# EAGLE schematic mux (EAGLE 7.1.0)
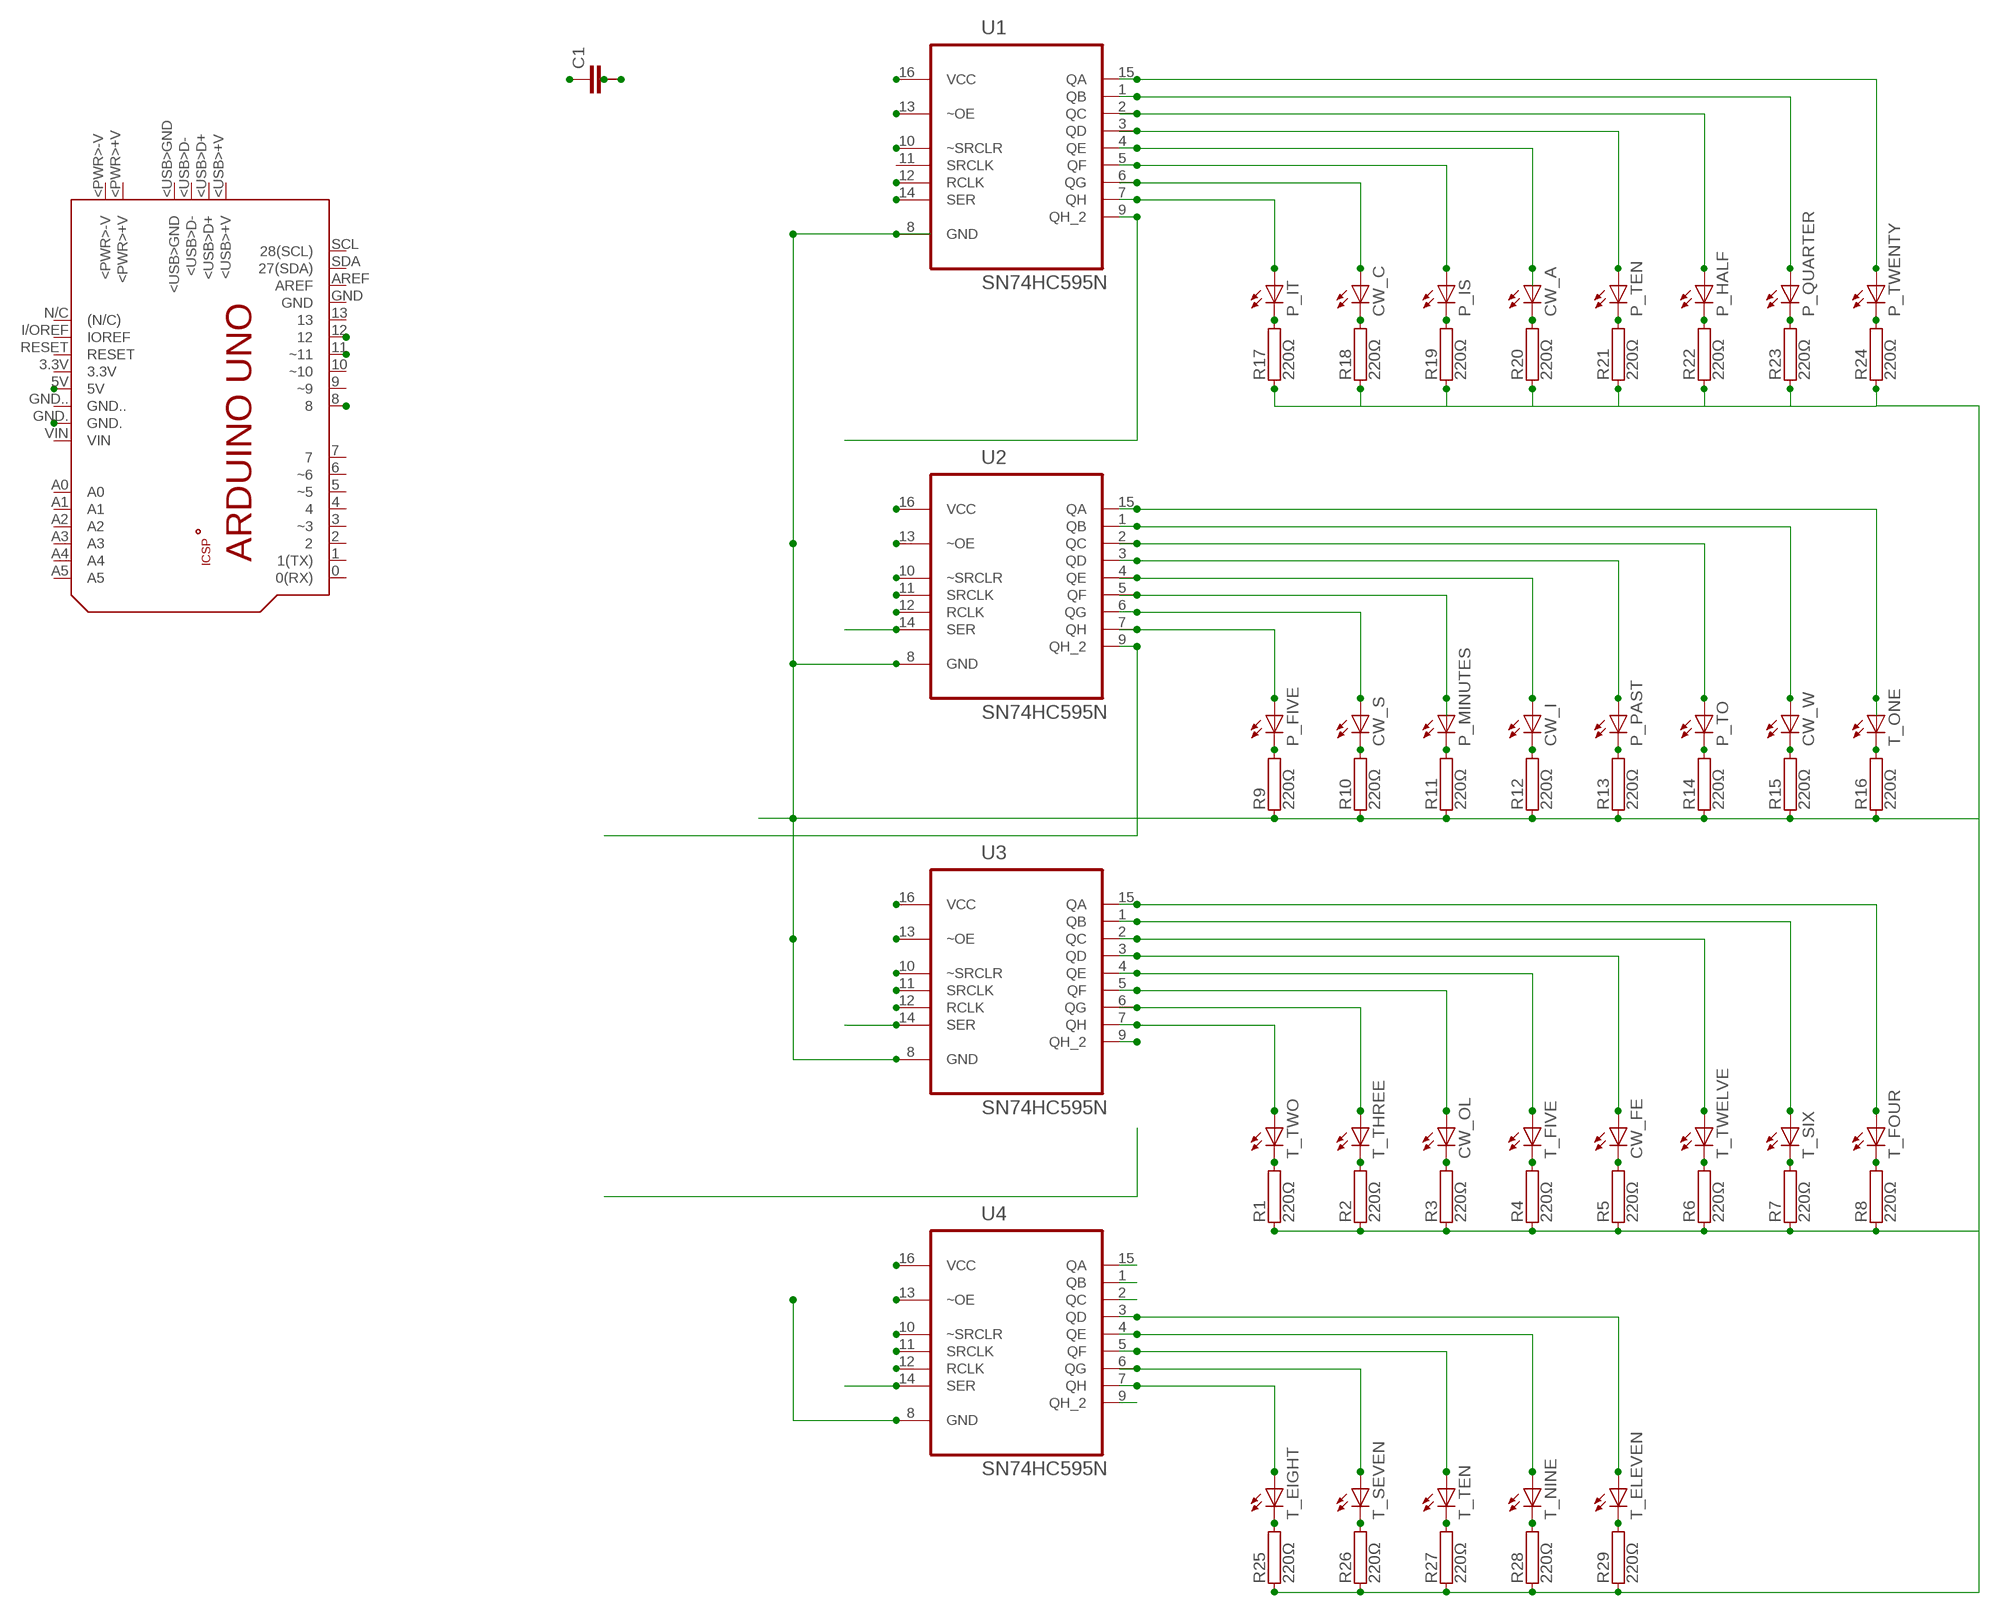
[diagram p0: schematic, sheet 1]

## Parts
C1  C-10-15/6  [C10-15B6]
CW_A  LEDSMT1206  [1206]
CW_C  LEDSMT1206  [1206]
CW_FE  LEDSMT1206  [1206]
CW_I  LEDSMT1206  [1206]
CW_OL  LEDSMT1206  [1206]
CW_S  LEDSMT1206  [1206]
CW_W  LEDSMT1206  [1206]
P_FIVE  LEDSMT1206  [1206]
P_HALF  LEDSMT1206  [1206]
P_IS  LEDSMT1206  [1206]
P_IT  LEDSMT1206  [1206]
P_MINUTES  LEDSMT1206  [1206]
P_PAST  LEDSMT1206  [1206]
P_QUARTER  LEDSMT1206  [1206]
P_TEN  LEDSMT1206  [1206]
P_TO  LEDSMT1206  [1206]
P_TWENTY  LEDSMT1206  [1206]
PCB1  ARDUINO_UNO  [ARDUINO_UNO]
R1  220Ω  RCA4050  [CA4050]
R2  220Ω  RCA4050  [CA4050]
R3  220Ω  RCA4050  [CA4050]
R4  220Ω  RCA4050  [CA4050]
R5  220Ω  RCA4050  [CA4050]
R6  220Ω  RCA4050  [CA4050]
R7  220Ω  RCA4050  [CA4050]
R8  220Ω  RCA4050  [CA4050]
R9  220Ω  RCA4050  [CA4050]
R10  220Ω  RCA4050  [CA4050]
R11  220Ω  RCA4050  [CA4050]
R12  220Ω  RCA4050  [CA4050]
R13  220Ω  RCA4050  [CA4050]
R14  220Ω  RCA4050  [CA4050]
R15  220Ω  RCA4050  [CA4050]
R16  220Ω  RCA4050  [CA4050]
R17  220Ω  RCA4050  [CA4050]
R18  220Ω  RCA4050  [CA4050]
R19  220Ω  RCA4050  [CA4050]
R20  220Ω  RCA4050  [CA4050]
R21  220Ω  RCA4050  [CA4050]
R22  220Ω  RCA4050  [CA4050]
R23  220Ω  RCA4050  [CA4050]
R24  220Ω  RCA4050  [CA4050]
R25  220Ω  RCA4050  [CA4050]
R26  220Ω  RCA4050  [CA4050]
R27  220Ω  RCA4050  [CA4050]
R28  220Ω  RCA4050  [CA4050]
R29  220Ω  RCA4050  [CA4050]
T_EIGHT  LEDSMT1206  [1206]
T_ELEVEN  LEDSMT1206  [1206]
T_FIVE  LEDSMT1206  [1206]
T_FOUR  LEDSMT1206  [1206]
T_NINE  LEDSMT1206  [1206]
T_ONE  LEDSMT1206  [1206]
T_SEVEN  LEDSMT1206  [1206]
T_SIX  LEDSMT1206  [1206]
T_TEN  LEDSMT1206  [1206]
T_THREE  LEDSMT1206  [1206]
T_TWELVE  LEDSMT1206  [1206]
T_TWO  LEDSMT1206  [1206]
U1  SN74HC595N  [DIP254P762X508-16]
U2  SN74HC595N  [DIP254P762X508-16]
U3  SN74HC595N  [DIP254P762X508-16]
U4  SN74HC595N  [DIP254P762X508-16]

## Nets
CW_C: CW_C.C R18.2
CW_W: CW_W.A U2.1(QB)
N$1: R1.2 T_TWO.C
N$2: R2.2 T_THREE.C
N$3: CW_OL.C R3.2
N$4: R4.2 T_FIVE.C
N$5: CW_FE.C R5.2
N$6: PCB1.GND.
N$7: R7.2 T_SIX.C
N$8: R8.2 T_FOUR.C
N$9: P_FIVE.C R9.2
N$10: CW_S.C R10.2
N$11: P_MINUTES.C R11.2
N$12: CW_I.C R12.2
N$13: P_PAST.C R13.2
N$14: P_TO.C R14.2
N$15: CW_W.C R15.2
N$16: R16.2 T_ONE.C
N$17: P_IT.C R17.2
N$18: R25.2 T_EIGHT.C
N$19: P_IS.C R19.2
N$20: CW_A.C R20.2
N$21: P_TEN.C R21.2
N$22: P_HALF.C R22.2
N$23: P_QUARTER.C R23.2
N$24: P_TWENTY.C R24.2
N$25: U1.9(QH_2)
N$26: PCB1.8
N$27: CW_I.A U2.4(QE)
N$28: U2.9(QH_2)
N$29: P_TO.A U2.2(QC)
N$30: PCB1.11(~11)
N$31: T_ONE.A U2.15(QA)
N$32: P_PAST.A U2.3(QD)
N$33: CW_S.A U2.6(QG)
N$34: P_FIVE.A U2.7(QH)
N$35: T_FIVE.A U3.4(QE)
N$36: P_MINUTES.A U2.5(QF)
N$37: T_THREE.A U3.6(QG)
N$38: CW_OL.A U3.5(QF)
N$39: CW_FE.A U3.3(QD)
N$40: T_TWELVE.A U3.2(QC)
N$41: T_SIX.A U3.1(QB)
N$42: T_FOUR.A U3.15(QA)
N$43: T_TWO.A U3.7(QH)
N$44: P_TWENTY.A U1.15(QA)
N$45: U3.9(QH_2)
N$46: U2.16(VCC)
N$47: U3.16(VCC)
N$48: U1.16(VCC)
N$49: PCB1.5V
N$50: C1.1
N$51: C1.2
N$52: P_IT.A U1.7(QH)
N$53: CW_C.A U1.6(QG)
N$54: P_IS.A U1.5(QF)
N$55: CW_A.A U1.4(QE)
N$56: P_TEN.A U1.3(QD)
N$57: P_QUARTER.A U1.1(QB)
N$58: P_HALF.A U1.2(QC)
N$59: C1.3
N$60: U1.13(~OE)
N$61: U2.13(~OE)
N$62: U3.13(~OE)
N$63: U3.10(~SRCLR)
N$64: U2.10(~SRCLR)
N$65: U1.10(~SRCLR)
N$66: U2.14(SER)
N$67: U3.14(SER)
N$68: U3.11(SRCLK)
N$69: U2.12(RCLK)
N$70: U1.14(SER)
N$71: U3.12(RCLK)
N$72: U1.12(RCLK)
N$73: R26.2 T_SEVEN.C
N$74: R27.2 T_TEN.C
N$75: R28.2 T_NINE.C
N$76: R29.2 T_ELEVEN.C
N$77: PCB1.12
N$80: R1.1 R2.1 R3.1 R4.1 R5.1 R6.1 R7.1 R8.1 R9.1 R10.1 R11.1 R12.1 R13.1 R14.1 R15.1 R16.1 R17.1 R18.1 R19.1 R20.1 R21.1 R22.1 R23.1 R24.1 R25.1 R26.1 R27.1 R28.1 R29.1 U1.8(GND) U2.8(GND) U3.8(GND) U4.8(GND)
N$81: T_SEVEN.A U4.6(QG)
N$82: T_TEN.A U4.5(QF)
N$83: T_ELEVEN.A U4.3(QD)
N$84: U4.2(QC)
N$85: U4.1(QB)
N$86: U4.15(QA)
N$87: T_NINE.A U4.4(QE)
N$88: T_EIGHT.A U4.7(QH)
N$90: U4.9(QH_2)
N$91: U4.16(VCC)
N$92: U4.13(~OE)
N$93: U4.10(~SRCLR)
N$94: U4.14(SER)
N$95: U4.11(SRCLK)
N$96: U4.12(RCLK)
T_TWELVE: R6.2 T_TWELVE.C
Unconnected: PCB1.0(0(RX)) PCB1.1(1(TX)) PCB1.2 PCB1.3(~3) PCB1.3.3V PCB1.4 PCB1.5(~5) PCB1.6(~6) PCB1.7 PCB1.9(~9) PCB1.10(~10) PCB1.13 PCB1.+5V PCB1.<PWR>+V PCB1.<PWR>-V PCB1.<USB>+V PCB1.<USB>D+ PCB1.<USB>D- PCB1.<USB>GND PCB1.A0 PCB1.A1 PCB1.A2 PCB1.A3 PCB1.A4 PCB1.A5 PCB1.AREF PCB1.GND PCB1.GND.. PCB1.GND_ PCB1.I/OREF(IOREF) PCB1.MISO PCB1.MOSI PCB1.N/C((N/C)) PCB1.RESET PCB1.RESET. PCB1.SCK PCB1.SCL(28(SCL)) PCB1.SDA(27(SDA)) PCB1.VIN U1.11(SRCLK) U2.11(SRCLK)

## Library data of the parts
C1 = capacitor-wima:C-: CAPACITOR for alternative placement naming: default grid - extended grid/package width
CW_A CW_C CW_FE CW_I CW_OL CW_S CW_W P_FIVE P_HALF P_IS P_IT P_MINUTES P_PAST P_QUARTER P_TEN P_TO P_TWENTY T_EIGHT T_ELEVEN T_FIVE T_FOUR T_NINE T_ONE T_SEVEN T_SIX T_TEN T_THREE T_TWELVE T_TWO = led:LED: LED OSRAM: - CHIPLED LG R971, LG N971, LY N971, LG Q971, LY Q971, LO R971, LY R971 LH N974, LH R974 LS Q976, LO Q976, LY Q976 LO Q996 - Hyper CHIPLED LW Q18S LB Q993, LB Q99A, LB R99A - SideLED LS A670, LO A670, LY A670, LG A670, LP A670 LB A673, LV A673, LT A673, LW A673 LH A674 LY A675 LS A676, LA A676, LO A676, LY A676, LW A676 LS A679, LY A679, LG A679 - Hyper Micro SIDELED® LS Y876, LA Y876, LO Y876, LY Y876 LT Y87S - SmartLED LW L88C, LW L88S LB L89C, LB L89S, LG L890 LS L89K, LO L89K, LY L89K LS L896, LA L896, LO L896, LY L896 - TOPLED LS T670, LO T670, LY T670, LG T670, LP T670 LSG T670, LSP T670, LSY T670, LOP T670, LYG T670 LG T671, LOG T671, LSG T671 LB T673, LV T673, LT T673, LW T673 LH T674 LS T676, LA T676, LO T676, LY T676, LB T676, LH T676, LSB T676, LW T676 LB T67C, LV T67C, LT T67C, LS T67K, LO T67K, LY T67K, LW E67C LS E67B, LA E67B, LO E67B, LY E67B, LB E67C, LV E67C, LT E67C LW T67C LS T679, LY T679, LG T679 LS T770, LO T770, LY T770, LG T770, LP T770 LB T773, LV T773, LT T773, LW T773 LH T774 LS E675, LA E675, LY E675, LS T675 LS T776, LA T776, LO T776, LY T776, LB T776 LHGB T686 LT T68C, LB T68C - Hyper Mini TOPLED® LB M676 - Mini TOPLED Santana® LG M470 LS M47K, LO M47K, LY M47K Source: http://www.osram.convergy.de LUXEON: - LUMILED® LXK2-PW12-R00, LXK2-PW12-S00, LXK2-PW14-U00, LXK2-PW14-V00 LXK2-PM12-R00, LXK2-PM12-S00, LXK2-PM14-U00 LXK2-PE12-Q00, LXK2-PE12-R00, LXK2-PE12-S00, LXK2-PE14-T00, LXK2-PE14-U00 LXK2-PB12-K00, LXK2-PB12-L00, LXK2-PB12-M00, LXK2-PB14-N00, LXK2-PB14-P00, LXK2-PB14-Q00 LXK2-PR12-L00, LXK2-PR12-M00, LXK2-PR14-Q00, LXK2-PR14-R00 LXK2-PD12-Q00, LXK2-PD12-R00, LXK2-PD12-S00 LXK2-PH12-R00, LXK2-PH12-S00 LXK2-PL12-P00, LXK2-PL12-Q00, LXK2-PL12-R00 Source: www.luxeon.com KINGBRIGHT: KA-3528ASYC Source: www.kingbright.com
PCB1 = E14_Arduino_published:ARDUINO_UNO: Device for representing an Arduino Uno board with a footprint in an EAGLE design. Created by Dave Young for Element14. More EAGLE documentation at: http://www.element14.com/community/community/knode/cadsoft_eagle
R1-R29 = resistor-power:R: Power Resitor; OC_FARNELL: unknown; OC_NEWARK: unknown
U1-U4 = SN74HC595N:SN74HC595N: 8-BIT SHIFT REGISTERS WITH 3-STATE OUTPUT REGISTERS; MPN: SN74HC595N; OC_FARNELL: 9591664; OC_NEWARK: 60K6845; PACKAGE: PDIP-16; SUPPLIER: Texas Instruments